# EAGLE design gaspmask (EAGLE 6.5.0)
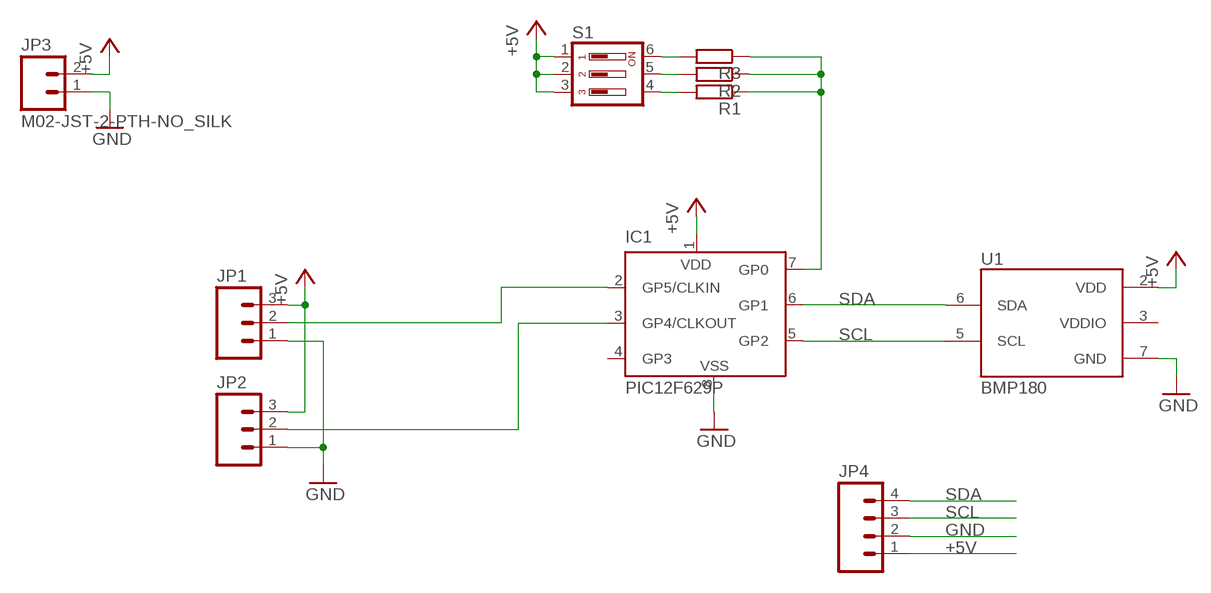
[diagram p0: schematic, sheet 1]

## Parts
IC1  PIC12F629P  [DIL8]
JP1  M03JST-PTH  [JST-3-PTH]
JP2  M03JST-PTH  [JST-3-PTH]
JP3  M02-JST-2-PTH-NO_SILK  [JST-2-PTH-NS]
JP4  M04LOCK_LONGPADS  [1X04_LOCK_LONGPADS]
R1  R-EU_0204/7  [0204/7]
R2  R-EU_0204/7  [0204/7]
R3  R-EU_0204/7  [0204/7]
S1  DIP03YL  [DIP03YL]
U1  BMP180  [BMP180]

## Nets
+5V: IC1.1(VDD) JP1.3 JP2.3 JP3.2 JP4.1 S1.1 S1.2 S1.3 U1.2(VDD)
GND: IC1.8(VSS) JP1.1 JP2.1 JP3.1 JP4.2 U1.7(GND)
N$2: IC1.3(GP4/CLKOUT) JP2.2
N$3: IC1.2(GP5/CLKIN) JP1.2
N$6: R1.2 S1.4
N$7: R2.2 S1.5
N$8: R3.2 S1.6
N$9: IC1.7(GP0) R1.1 R2.1 R3.1
SCL: IC1.5(GP2) JP4.3 U1.5(SCL)
SDA: IC1.6(GP1) JP4.4 U1.6(SDA)
Unconnected: IC1.4(GP3)

## Power pins joined to a net without a drawn wire
VDDIO: U1.3(VDDIO)

## Library data of the parts
IC1 = microchip-update-2:PIC12F6*: Data Sheet 8-Pin FLASH-Based 8-Bit CMOS Microcontrollers Source: http://www.microchip.com .. 41190c.pdf
JP1 JP2 = SparkFun-Connectors:M03: Header 3 Standard 3-pin 0.1" header. Use with straight break away headers (SKU : PRT-00116), right angle break away headers (PRT-00553), swiss pins (PRT-00743), machine pins (PRT-00117), and female headers (PRT-00115). Molex polarized connector foot print use with SKU : PRT-08232 with associated crimp pins and housings.; SKU: PRT-09915
JP3 = SparkFun-Connectors:M02: Standard 2-pin 0.1" header. Use with - straight break away headers ( PRT-00116) - right angle break away headers (PRT-00553) - swiss pins (PRT-00743) - machine pins (PRT-00117) - female headers (PRT-00115) Molex polarized connector foot print use with: PRT-08233 with associated crimp pins and housings. 2.54_SCREWTERM for use with PRT-10571. 3.5mm Screw Terminal footprints for PRT-08084 5mm Screw Terminal footprints for use with PRT-08433
JP4 = SparkFun-Connectors:M04: Header 4 Standard 4-pin 0.1" header. Use with straight break away headers (SKU : PRT-00116), right angle break away headers (PRT-00553), swiss pins (PRT-00743), machine pins (PRT-00117), and female headers (PRT-00115). Molex polarized connector foot print use with SKU : PRT-08231 with associated crimp pins and housings. 1MM SMD Version SKU: PRT-10208
R1-R3 = rcl:R-EU_: RESISTOR, European symbol
S1 = switch-dil:DIP03YL: DIL/CODE SWITCH; OC_FARNELL: unknown; OC_NEWARK: unknown
U1 = SparkFun-Sensors:BMP180: BOSCH BMP180 DIGITAL BAROMETRIC PRESSURE SENSOR Web page: http://www.bosch-sensortec.com/en/homepage/products_3/environmental_sensors_1/bmp180_1/bmp180 Datasheet: http://ae-bst.resource.bosch.com/media/products/dokumente/bmp180/BST-BMP180-DS000-09.pdf The BMP180 is the function compatible successor of the BMP085, a new generation of high precision digital pressure sensors for consumer applications. The ultra-low power, low voltage electronics of the BMP180 is optimized for use in mobile phones, PDAs, GPS navigation devices and outdoor equipment. With a low altitude noise of merely 0.25m at fast conversion time, the BMP180 offers superior performance. The I2C interface allows for easy system integration with a microcontroller. The BMP180 is based on piezo-resistive technology for EMC robustness, high accuracy and linearity as well as long term stability. Key features: - Temperature measurement included - I2C interface - Fully calibrated - Pb-free, halogen-free and RoHS compliant, - MSL 1 Basic specs: Pressure range: 300 to 1100hPa (+9000m to -500m relating to sea level) Supply voltage: 1.8 to 3.6V (VDD), 1.62V to 3.6V (VDDIO) Package: LGA package with metal lid Small footprint: 3.6mm x 3.8mm Super-flat: 0.93mm height Low power: 5μA at 1 sample / sec. in standard mode Low noise: 0.06hPa (0.5m) in ultra low power mode, 0.02hPa (0.17m) advanced resolution mode Typical applications: - Enhancement of GPS navigation (dead-reckoning, slope detection, etc.) - In- and out-door navigation - Leisure and sports - Weather forecast - Vertical velocity indication (rise/sink speed)

## Board
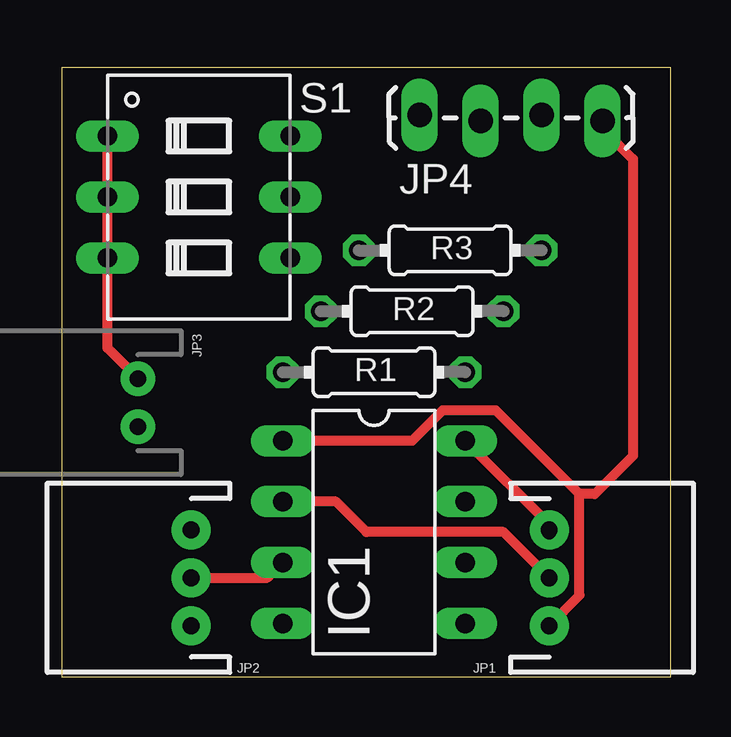
[diagram p1: board, top side]
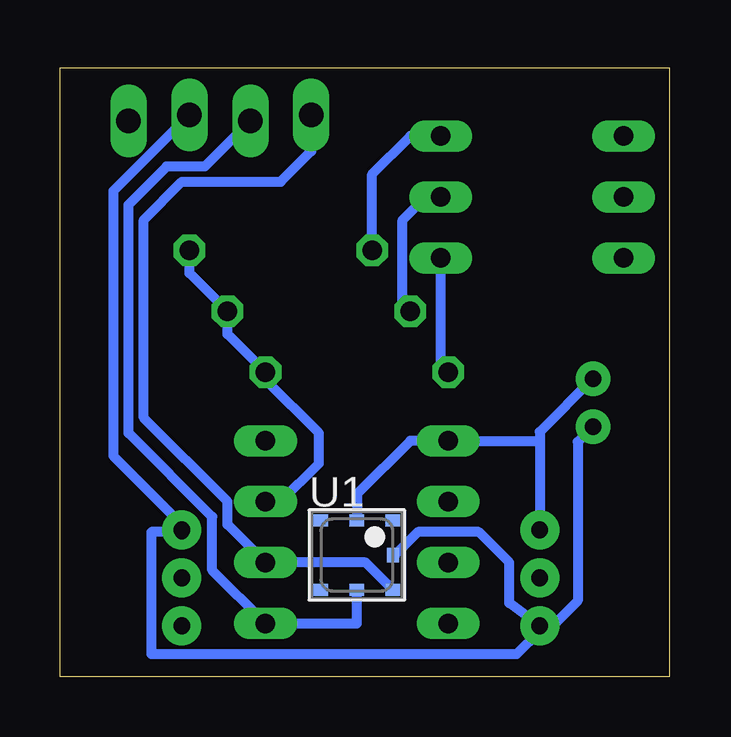
[diagram p2: board, bottom side, seen from below]

Size 25.4 x 25.4 mm. Coordinates in mm from the lower left corner, seen from the top.
Outline: 0,0 25.4,0 25.4,25.4 0,25.4 0,0
Copper layers (1*16): Top 0.035mm / dielectric 1.5mm / Bottom 0.035mm
Design rules "default": minimum track width 10mil, minimum drill 24mil, track to track 8mil, track to pad 8mil, pad to pad 8mil, via to via 8mil, smd to smd 8mil, copper to edge 40mil, drill to drill 8mil, minimum pad ring 10mil, minimum via ring 8mil, stop-mask expansion 4mil, vias tented up to drill 0mil, thermal gap 10mil

### Footprints (pad centres in the part's own frame; a part is rotated, then mirrored left to right if it is on the bottom)
DIL8 = drill 0.813 long: 1 -3.81,-3.81; 2 -1.27,-3.81; 3 1.27,-3.81; 4 3.81,-3.81; 5 3.81,3.81; 6 1.27,3.81; 7 -1.27,3.81; 8 -3.81,3.81
JST-3-PTH = drill 0.7 pad 1.626: 1 -2,0; 2 0,0; 3 2,0
JST-2-PTH-NS = drill 0.7 pad 1.448: 1 -1,0; 2 1,0
1X04_LOCK_LONGPADS = drill 1.016 long: 1 0,0; 2 2.54,-0.254; 3 5.08,0; 4 7.62,-0.254
0204/7 = drill 0.813 octagon: 1 -3.81,0; 2 3.81,0
DIP03YL = drill 0.813 long: 1 -2.54,-3.81; 2 0,-3.81; 3 2.54,-3.81; 4 2.54,3.81; 5 0,3.81; 6 -2.54,3.81
BMP180 = smd 0.6 x 0.5: 1 1.5,1.45; 2 0,1.45; 3 -1.5,1.45; 4 -1.5,-1.45; 5 0,-1.45; 6 1.5,-1.45 | smd 0.5 x 0.6: 7 1.5,0

### Placement (x,y rotation side)
IC1  13.02,6.03 270 top
JP1  20.32,4.13 270 top
JP2  5.4,4.13 90 top
JP3  3.17,11.43 90 top
JP4  22.54,23.18 180 top
R1  13.02,12.7 180 top
R2  14.61,15.24 180 top
R3  16.19,17.78 180 top
S1  5.71,20 270 top
U1  13.02,5.08 0 bottom

### Tracks (layer width: path | path; a pad name or v marks a point on that pad's centre or on a via)
+5V
  Top 0.406: JP1.3 21.59,3.4 21.59,7.62 | 21.59,7.62 18.1,11.11 15.88,11.11 14.61,9.84 IC1.1 | JP3.2 1.91,13.7 S1.3 S1.2 S1.1 | JP4.1 22.54,22.86 23.81,21.59 23.81,9.21 22.23,7.62 21.59,7.62
  Bottom 0.406: U1.2 13.02,7.62 10.79,9.84 IC1.1 5.4,9.84 | JP3.2 5.4,10.21 5.4,9.84 | 5.4,9.84 JP2.3
GND  (via drill 0.6)
  Top 0.406: IC1.8 20.32,6.35 JP1.1 v20.32,6.03
  Bottom 0.406: JP2.1 6.67,3.08 6.67,4.76 7.94,6.03 10.48,6.03 11.43,5.08 U1.7 | JP3.1 3.81,9.79 3.81,3.17 4.86,2.13 JP2.1 | v20.32,6.03 21.59,6.03 21.59,0.95 6.35,0.95 5.4,1.91 JP2.1 | JP4.2 23.18,20.26 23.18,9.21 20.32,6.35 JP1.1
N$2
  Top 0.406: JP2.2 8.57,4.13 IC1.3
N$3
  Top 0.406: JP1.2 18.41,6.03 12.7,6.03 11.43,7.3 IC1.2
N$6
  Bottom 0.406: R1.2 9.53,13.02 S1.4
N$7
  Bottom 0.406: R2.2 11.11,15.56 11.11,19.05 10.16,20 S1.5
N$8
  Bottom 0.406: R3.2 12.38,20.95 10.79,22.54 S1.6
N$9
  Bottom 0.406: IC1.7 16.19,7.3 14.61,8.89 14.61,10.16 16.83,12.38 R1.1 18.41,14.29 R2.1 20,16.83 R3.1
SCL
  Bottom 0.406: U1.5 13.02,2.22 IC1.5 19.05,4.45 19.05,6.67 22.54,10.16 22.54,19.68 20.95,21.27 19.37,21.27 JP4.3
SDA
  Bottom 0.406: U1.6 12.65,4.76 IC1.6 18.41,6.35 18.41,7.3 21.91,10.79 21.91,19.05 20.32,20.64 16.19,20.64 14.92,21.91 JP4.4